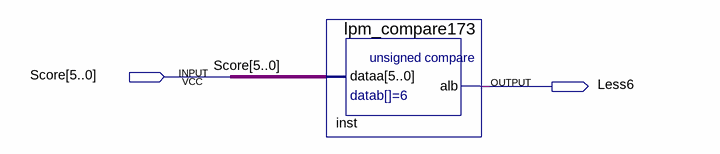
[diagram p0: schematic sheet]
// Quartus schematic Less6.bdf as structural Verilog: 1 symbols, 2 pins
module Less6 (
  input  [5:0] Score,
  output Less6
);

  lpm_compare173 inst (.dataa(Score), .alb(Less6));
endmodule
